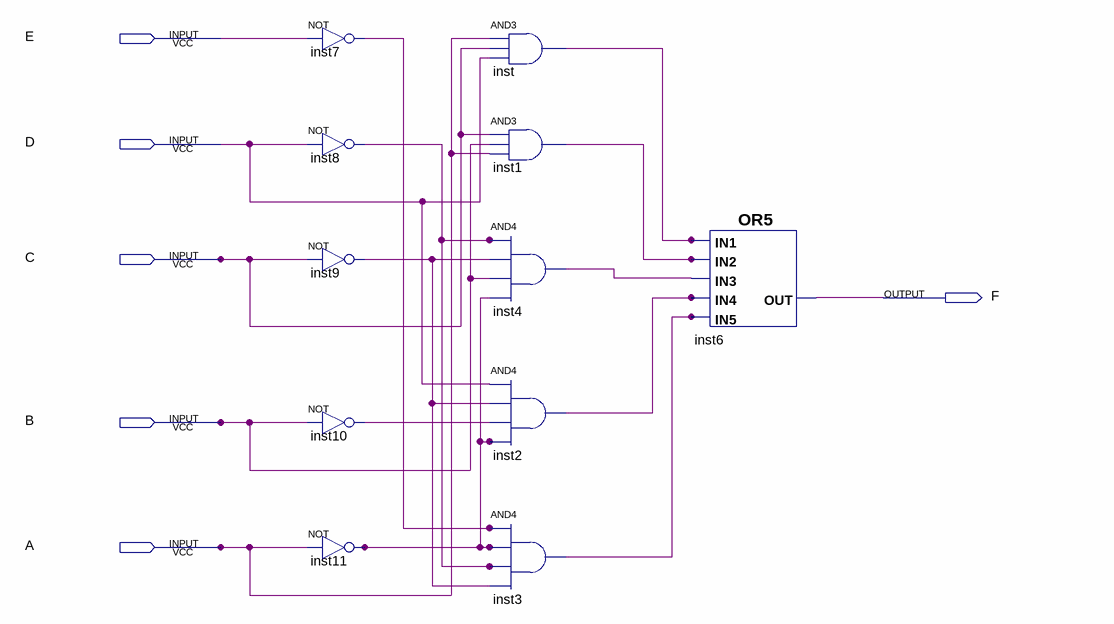
[diagram p0: schematic sheet]
// Quartus schematic esquematico.bdf as structural Verilog: 11 symbols, 6 pins
module esquematico (
  input  E,
  input  D,
  input  C,
  input  B,
  input  A,
  output F
);

  wire inst1_out, inst2_out, inst3_out, inst4_out, inst7_out, inst8_out, inst9_out, inst10_out, inst11_out,
       inst_out;

  not inst7 (inst7_out, E);
  not inst8 (inst8_out, D);
  not inst9 (inst9_out, C);
  not inst10 (inst10_out, B);
  not inst11 (inst11_out, A);
  and inst (inst_out, A, C, D);
  and inst1 (inst1_out, C, B, A);
  and inst4 (inst4_out, inst8_out, inst9_out, B, inst11_out);
  and inst2 (inst2_out, D, inst9_out, inst10_out, inst11_out);
  and inst3 (inst3_out, inst7_out, inst11_out, inst8_out, inst9_out);
  or inst6 (F, inst_out, inst1_out, inst4_out, inst2_out, inst3_out);
endmodule
